# Altium schematic sheet [03] - MCU and Conn.SchDoc
size A3; DocumentNumber: 3; SheetNumber: 3; SheetTotal: 3
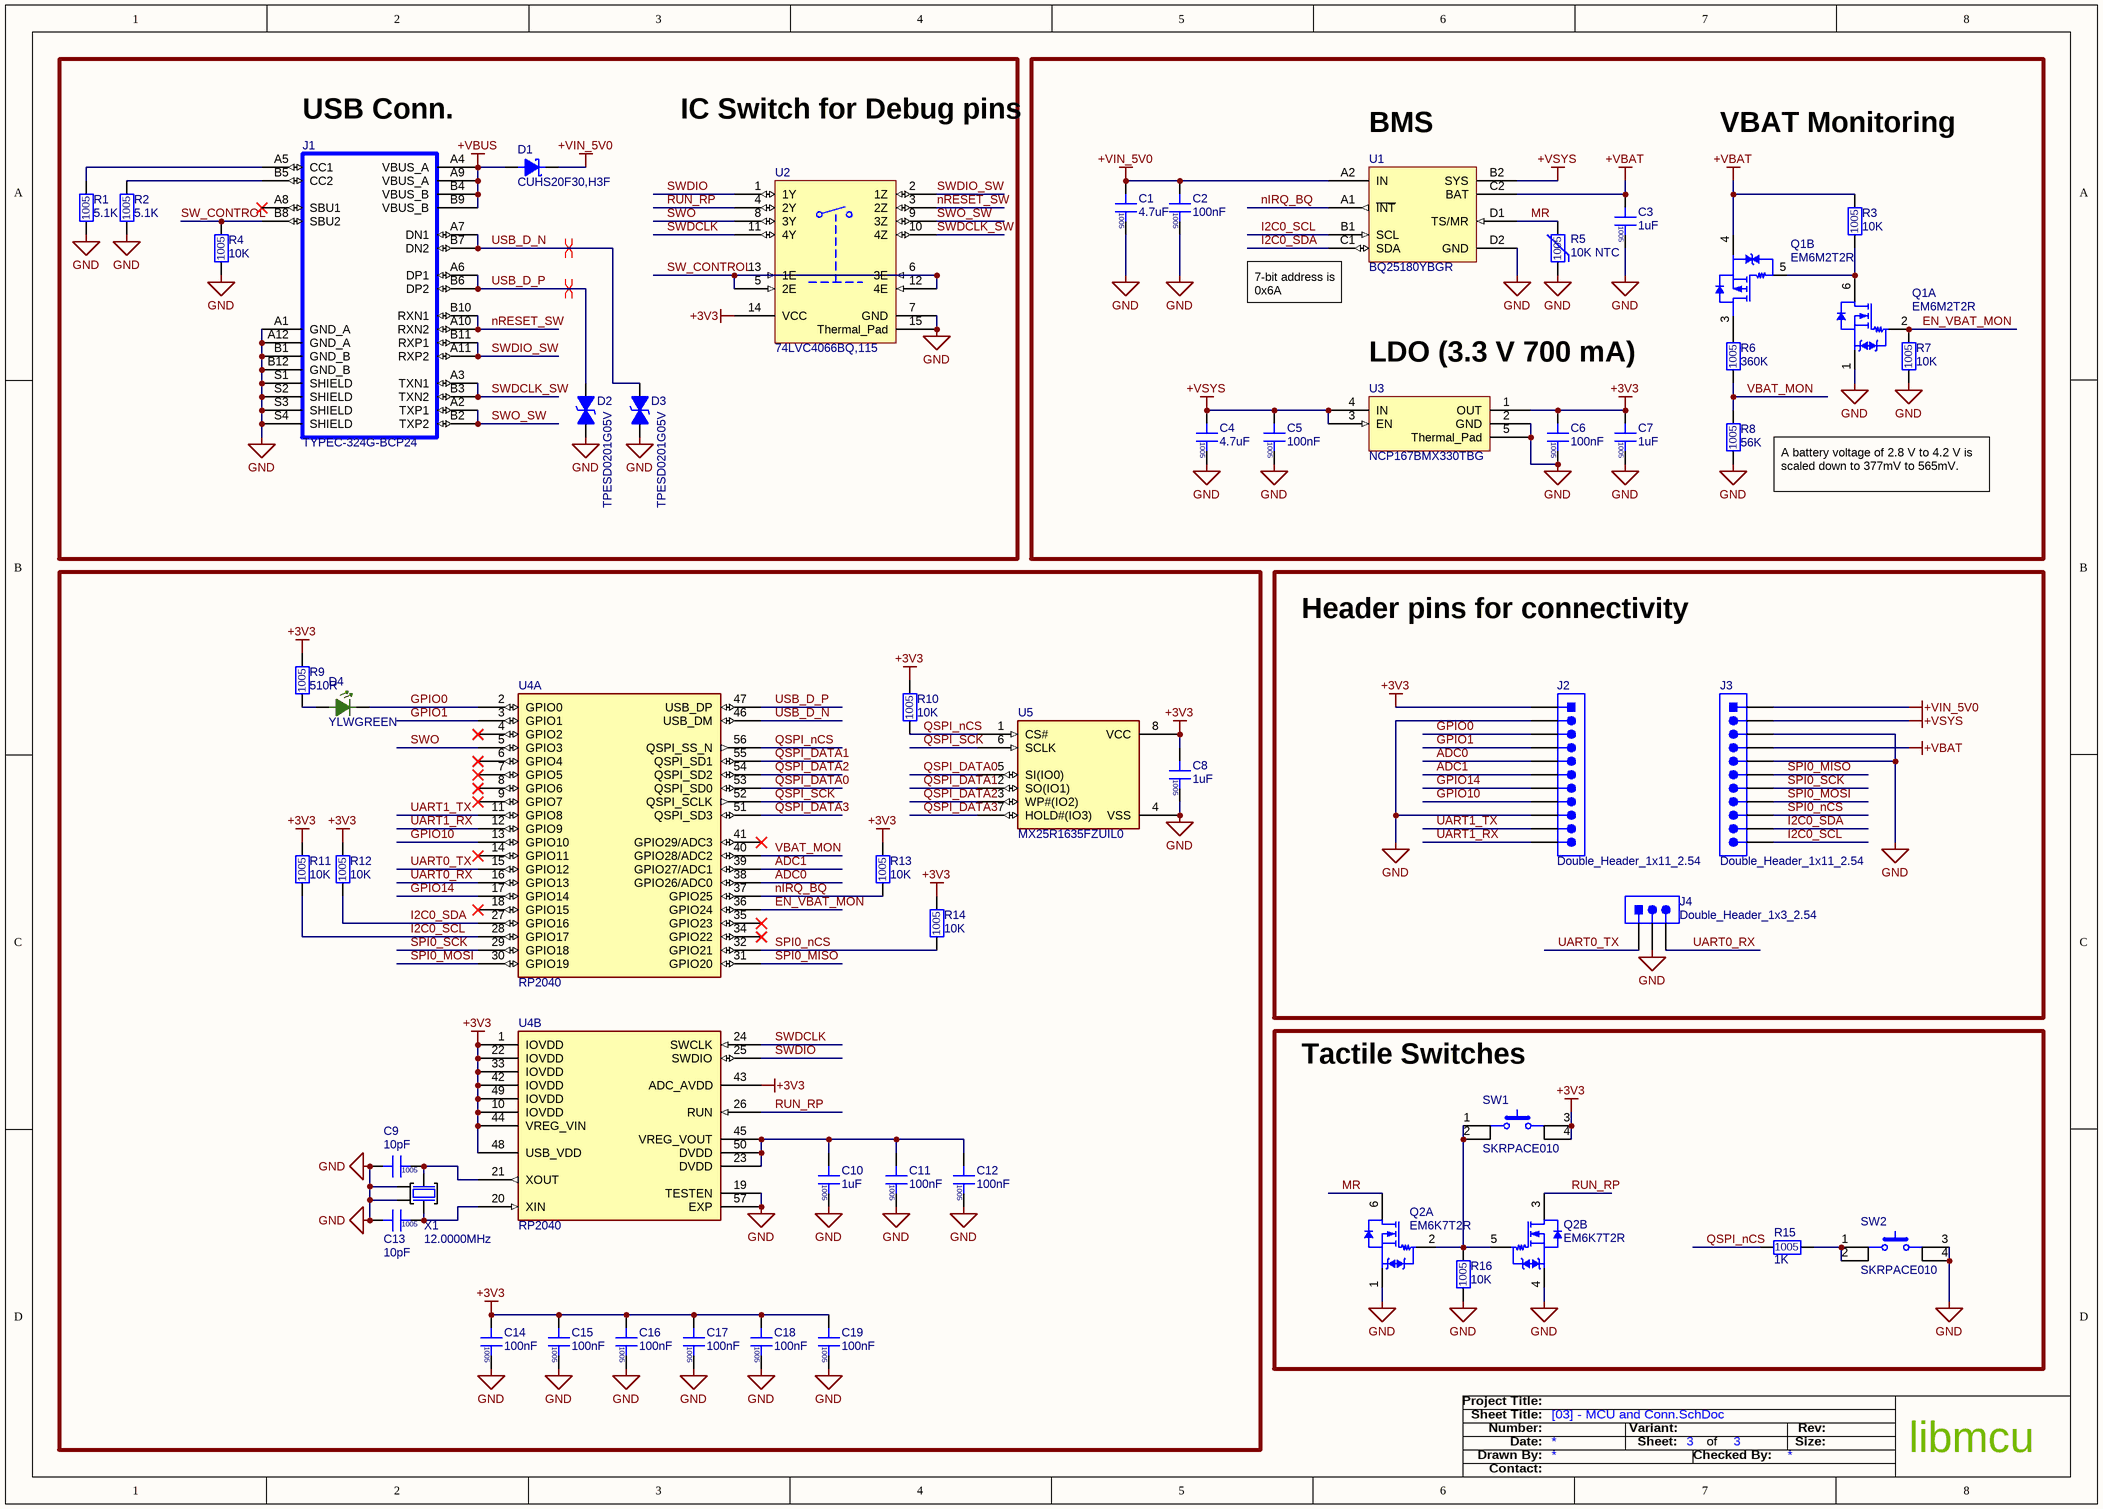
[diagram p0: [03] - MCU and Conn.SchDoc]

## Parts
C1  4.7uF  [CAPC1005X06N]
C2  100nF  [CAPC1005X06N]
C3  1uF  [CAPC1005X06N]
C4  4.7uF  [CAPC1005X06N]
C5  100nF  [CAPC1005X06N]
C6  100nF  [CAPC1005X06N]
C7  1uF  [CAPC1005X06N]
C8  1uF  [CAPC1005X06N]
C9  10pF  [CAPC1005X06N]
C10  1uF  [CAPC1005X06N]
C11  100nF  [CAPC1005X06N]
C12  100nF  [CAPC1005X06N]
C13  10pF  [CAPC1005X06N]
C14  100nF  [CAPC1005X06N]
C15  100nF  [CAPC1005X06N]
C16  100nF  [CAPC1005X06N]
C17  100nF  [CAPC1005X06N]
C18  100nF  [CAPC1005X06N]
C19  100nF  [CAPC1005X06N]
D1  CUHS20F30,H3F  [US2H-DIODE]
D2  TPESD0201G05V  [DIOC0603X03N]
D3  TPESD0201G05V  [DIOC0603X03N]
D4  YLWGREEN  [LDIOC1608X08N]
J1  TYPEC-324G-BCP24  [KUSBX-SMT3-CS-BTR_KYC]
J2  Double_Header_1x11_2.54  [1x11_DOUBLE_HEADER_2.54]  (no BOM)
J3  Double_Header_1x11_2.54  [1x11_DOUBLE_HEADER_2.54]  (no BOM)
J4  Double_Header_1x3_2.54  [1x3_DOUBLE_HEADER_2.54]  (no BOM)
Q1  EM6M2T2R  [SOTFL50P160X55-6N]  (parts A,B of 2)
Q2  EM6K7T2R  [SOTFL50P160X55-6N]  (parts A,B of 2)
R1  5.1K  [RESC1005X04N]
R2  5.1K  [RESC1005X04N]
R3  10K  [RESC1005X04N]
R4  10K  [RESC1005X04N]
R5  10K NTC  [NTC1005X05N]
R6  360K  [RESC1005X04N]
R7  10K  [RESC1005X04N]
R8  56K  [RESC1005X04N]
R9  510R  [RESC1005X04N]
R10  10K  [RESC1005X04N]
R11  10K  [RESC1005X04N]
R12  10K  [RESC1005X04N]
R13  10K  [RESC1005X04N]
R14  10K  [RESC1005X04N]
R15  1K  [RESC1005X04N]
R16  10K  [RESC1005X04N]
SW1  SKRPACE010  [PTS810]
SW2  SKRPACE010  [PTS810]
U1  BQ25180YBGR  [BGA8C40P2X4_100X155X50_YBG0008]
U2  74LVC4066BQ,115  [QFN50P250X300X100_HS-15N]
U3  NCP167BMX330TBG  [NCP167]
U4  RP2040  [QFN40P700X700X90_HS-57N_RP2040]  (parts A,B of 2)
U5  MX25R1635FZUIL0  [USON8_3X2]
X1  12.0000MHz  [XT2520]

## Blocks framed on the sheet
Header pins for connectivity: J2-J4
Tactile Switches: Q2 R15 R16 SW1 SW2

## Nets
+3V3: C6.2 C7.2 C8.2 C14.2 C15.2 C16.2 C17.2 C18.2 C19.2 J2.1 R9.1 R10.2 R11.2 R12.2 R13.2 R14.2 SW1.3 SW1.4 U2.14(VCC) U3.1(OUT) U4.1(IOVDD) U4.10(IOVDD) U4.22(IOVDD) U4.33(IOVDD) U4.42(IOVDD) U4.43(ADC_AVDD) U4.44(VREG_VIN) U4.48(USB_VDD) U4.49(IOVDD) U5.8(VCC)
+VBAT: C3.2 J3.4 Q1.4(S) R3.2 U1.C2(BAT)
+VBUS: D1.2(Anode) J1.A4(VBUS_A) J1.A9(VBUS_A) J1.B4(VBUS_B) J1.B9(VBUS_B)
+VIN_5V0: C1.2 C2.2 D1.1(Cathode) J3.1 U1.A2(IN)
+VSYS: C4.2 C5.2 J3.2 U1.B2(SYS) U3.3(EN) U3.4(IN)
GND: C1.1 C2.1 C3.1 C4.1 C5.1 C6.1 C7.1 C8.1 C9.2 C10.1 C11.1 C12.1 C13.2 C14.1 C15.1 C16.1 C17.1 C18.1 C19.1 D2.2 D3.2 J1.A1(GND_A) J1.A12(GND_A) J1.B1(GND_B) J1.B12(GND_B) J1.S1(SHIELD) J1.S2(SHIELD) J1.S3(SHIELD) J1.S4(SHIELD) J2.2 J2.9 J3.3 J3.5 J4.2 Q1.1(S) Q2.1(S) Q2.4(S) R1.1 R2.1 R4.1 R5.1 R7.1 R8.1 R16.1 SW2.3 SW2.4 U1.D2(GND) U2.7(GND) U2.15(Thermal_Pad) U3.2(GND) U3.5(Thermal_Pad) U4.19(TESTEN) U4.57(EXP) U5.4(VSS) X1.2(GND) X1.4(GND)
ADC0: J2.5 U4.38(GPIO26/ADC0)
ADC1: J2.6 U4.39(GPIO27/ADC1)
EN_VBAT_MON: Q1.2(G) R7.2 U4.36(GPIO24)
GPIO0: D4.K J2.3 U4.2(GPIO0)
GPIO1: J2.4 U4.3(GPIO1)
GPIO10: J2.8 U4.13(GPIO10)
GPIO14: J2.7 U4.17(GPIO14)
I2C0_SCL: J3.11 R11.1 U1.B1(SCL) U4.28(GPIO17)
I2C0_SDA: J3.10 R12.1 U1.C1(SDA) U4.27(GPIO16)
MR: Q2.6(D) R5.2 U1.D1(TS/MR)
nIRQ_BQ: R13.1 U1.A1(~{INT}) U4.37(GPIO25)
nRESET_SW: J1.A10(RXN2) J1.B10(RXN1) U2.3(2Z)
QSPI_DATA0: U4.53(QSPI_SD0) U5.5(SI(IO0))
QSPI_DATA1: U4.55(QSPI_SD1) U5.2(SO(IO1))
QSPI_DATA2: U4.54(QSPI_SD2) U5.3(WP#(IO2))
QSPI_DATA3: U4.51(QSPI_SD3) U5.7(HOLD#(IO3))
QSPI_nCS: R10.1 R15.1 U4.56(QSPI_SS_N) U5.1(CS#)
QSPI_SCK: U4.52(QSPI_SCLK) U5.6(SCLK)
RUN_RP: Q2.3(D) U2.4(2Y) U4.26(RUN)
SPI0_MISO: J3.6 U4.31(GPIO20)
SPI0_MOSI: J3.8 U4.30(GPIO19)
SPI0_nCS: J3.9 R14.1 U4.32(GPIO21)
SPI0_SCK: J3.7 U4.29(GPIO18)
SW_CONTROL: J1.B8(SBU2) R4.2 U2.5(2E) U2.6(3E) U2.12(4E) U2.13(1E)
SWDCLK: U2.11(4Y) U4.24(SWCLK)
SWDCLK_SW: J1.A3(TXN1) J1.B3(TXN2) U2.10(4Z)
SWDIO: U2.1(1Y) U4.25(SWDIO)
SWDIO_SW: J1.A11(RXP2) J1.B11(RXP1) U2.2(1Z)
SWO: U2.8(3Y) U4.5(GPIO3)
SWO_SW: J1.A2(TXP1) J1.B2(TXP2) U2.9(3Z)
UART0_RX: J4.3 U4.16(GPIO13)
UART0_TX: J4.1 U4.15(GPIO12)
UART1_RX: J2.11 U4.12(GPIO9)
UART1_TX: J2.10 U4.11(GPIO8)
USB_D_N: D3.1 J1.A7(DN1) J1.B7(DN2) U4.46(USB_DM)
USB_D_P: D2.1 J1.A6(DP1) J1.B6(DP2) U4.47(USB_DP)
VBAT_MON: R6.1 R8.2 U4.40(GPIO28/ADC2)
NetC9_1: C9.1 U4.21(XOUT) X1.1(IN)
NetC10_2: C10.2 C11.2 C12.2 U4.23(DVDD) U4.45(VREG_VOUT) U4.50(DVDD)
NetC13_1: C13.1 U4.20(XIN) X1.3(OUT)
NetD4_A: D4.A R9.2
NetJ1_A5: J1.A5(CC1) R1.2
NetJ1_B5: J1.B5(CC2) R2.2
NetQ1_3: Q1.3(D) R6.2
NetQ1_5: Q1.5(G) Q1.6(D) R3.1
NetQ2_2: Q2.2(G) Q2.5(G) R16.2 SW1.1 SW1.2
NetR15_2: R15.2 SW2.1 SW2.2

Not connected (* = marked no-connect by the designer): J1 A8(SBU1)*; U4 4(GPIO2)* 6(GPIO4)* 7(GPIO5)* 8(GPIO6)* 9(GPIO7)* 14(GPIO11)* 18(GPIO15)* 34(GPIO22)* 35(GPIO23)* 41(GPIO29/ADC3)*

## Layout directives
differential pair; differential pair class DIFF90: USB_D_N, USB_D_P

## Notes on the sheet
- (near J1) USB Conn.
- IC Switch for Debug pins
- (near U1) BMS
- VBAT Monitoring
- (near U1) 7-bit address is 0x6A
- LDO (3.3 V 700 mA)
- (near R8) A battery voltage of 2.8 V to 4.2 V is scaled down to 377mV to 565mV.
- Project Title:
- Number:
- Date:
- Sheet Title:
- Drawn By:
- Sheet:
- Variant:
- of
- Checked By:
- Rev:
- Size:
- libmcu
- Contact:

## Library data of the parts
C1 C4 = CL05A475MP5NRNC: CAP CER 4.7UF 10V X5R 0402; Manufacturer: Samsung; Tolerance: 20%; Supplier 1: Digi-Key; Supplier Part Number 1: 1276-1482-1-ND; Manufacturer Part Number: CL05A475MP5NRNC; RoHS: Yes; Category: Ceramic Capacitors; Stock 1: 6997940; Pricing 1: 1=0.10000, 10=0.06800, 50=0.03680, 100=0.03010, 500=0.02150, 1000=0.01689, 2500=0.01535, 5000=0.01412 (USD); Mount: Surface Mount; Case/Package: 0402; Case Code (Metric): 1005; Case Code (Imperial): 0402; Min Operating Temperature: -55°C; Max Operating Temperature: 85°C; Package Quantity: 10000; Packaging: Tape and Reel; Capacitance: 4.7uF; Voltage Rating: 10V; Dielectric: X5R; Series: CL; Length: 0.039inch; Width: 0.02inch; Thickness: 0.022inch; Lead Free: Lead Free; RoHS Compliant: Yes; ComponentLink1URL: https://datasheet.ciiva.com/25786/cl05a475mp5nrnc-25786963.pdf?src-supplier=Digi-Key; ComponentLink1Description: https://datasheet.ciiva.com/25786/cl05a475mp5nrnc-25786963.pdf?src-supplier=Digi-Key; ComponentLink2URL: https://datasheet.ciiva.com/16437/cl05b104kq5nnnc-16437353.pdf?src-supplier=Future+Electronics; ComponentLink2Description: https://datasheet.ciiva.com/16437/cl05b104kq5nnnc-16437353.pdf?src-supplier=Future+Electronics
C2 C5 C6 C11 C12 C14-C19 = CL05B104KO5NNNC: CAP CER 0.1UF 16V X7R 0402; Manufacturer: Samsung; Material: Ceramic; Tolerance: 10%; Supplier 1: Digi-Key; Supplier Part Number 1: 1276-1001-1-ND; Manufacturer Part Number: CL05B104KO5NNNC; RoHS: Yes; Category: Ceramic Capacitors; Stock 1: 21029609; Pricing 1: 1=0.10000, 10=0.02600, 50=0.01400, 100=0.01150, 500=0.00820, 1000=0.00644, 2500=0.00586, 5000=0.00539 (USD); Mount: Surface Mount; Case/Package: 0402; Case Code (Metric): 1005; Case Code (Imperial): 0402; Contact Plating: Tin; Min Operating Temperature: -55°C; Max Operating Temperature: 125°C; Capacitance: 100nF; Dielectric: X7R; Package Quantity: 1; Packaging: Tape and Reel; Voltage Rating: 16V; Voltage: 16V; Voltage Rating (DC): 16V; Length: 1mm; Width: 0.02inch; Height: 0.5mm; Thickness: 0.022inch; Depth: 0.5mm; Radiation Hardening: No; Lead Free: Lead Free; ComponentLink1URL: https://datasheet.ciiva.com/26920/getdatasheetpartid-359683-26920169.pdf?src-supplier=Verical; ComponentLink1Description: https://datasheet.ciiva.com/26920/getdatasheetpartid-359683-26920169.pdf?src-supplier=Verical; ComponentLink2URL: https://datasheet.ciiva.com/29198/458718-da-01-en-vs-kondensator-0402-29198423.pdf?src-supplier=Conrad; ComponentLink2Description: https://datasheet.ciiva.com/29198/458718-da-01-en-vs-kondensator-0402-29198423.pdf?src-supplier=Conrad; ComponentLink3URL: https://datasheet.ciiva.com/16208/cl05b104kq5nnnc-16208343.pdf?src-supplier=Future+Electronics; ComponentLink3Description: https://datasheet.ciiva.com/16208/cl05b104kq5nnnc-16208343.pdf?src-supplier=Future+Electronics; ComponentLink4URL: https://datasheet.ciiva.com/26309/mlcc-catalogdownload2013-eng-26309003.pdf?src-supplier=Distrelec; ComponentLink4Description: https://datasheet.ciiva.com/26309/mlcc-catalogdownload2013-eng-26309003.pdf?src-supplier=Distrelec
C3 C7 C8 C10 = CL05A105KO5NNNC: CAP CER 1UF 16V X5R 0402; Manufacturer: Samsung; Tolerance: 10%; Supplier 1: Digi-Key; Supplier Part Number 1: 1276-1067-1-ND; Manufacturer Part Number: CL05A105KO5NNNC; RoHS: Yes; Category: Ceramic Capacitors; Stock 1: 2455652; Pricing 1: 1=0.10000, 10=0.04400, 50=0.02400, 100=0.01960, 500=0.01402, 1000=0.01101, 2500=0.01001, 5000=0.00921 (USD); Mount: Surface Mount; Case/Package: 0402; Contact Plating: Tin; Case Code (Imperial): 0402; Case Code (Metric): 1005; Min Operating Temperature: -55°C; Max Operating Temperature: 85°C; Capacitance: 1uF; Dielectric: X5R; Packaging: Tape and Reel; Package Quantity: 1; Voltage Rating: 16V; Voltage: 16V; Length: 1mm; Width: 0.02inch; Height: 0.5mm; Thickness: 0.022inch; Depth: 0.5mm; Radiation Hardening: No; ComponentLink1URL: https://datasheet.ciiva.com/16207/cl05a105ko5nnnc-16207571.pdf?src-supplier=Future+Electronics; ComponentLink1Description: https://datasheet.ciiva.com/16207/cl05a105ko5nnnc-16207571.pdf?src-supplier=Future+Electronics; ComponentLink2URL: https://datasheet.ciiva.com/15195/getdatasheetpartid-355272-15195629.pdf?src-supplier=Verical; ComponentLink2Description: https://datasheet.ciiva.com/15195/getdatasheetpartid-355272-15195629.pdf?src-supplier=Verical
C9 C13 = CL05C100DB5NNNC: CAP CER 10PF 50V C0G/NP0 0402; Manufacturer 1: Samsung; Dielectric: C0G; Category 1: Capacitors; Category 2: Ceramic Capacitors; Supplier 1: Digi-Key; Manufacturer Part Number 1: CL05C100DB5NNNC; Stock 1: 197409; Pricing 1: 1=0.10000, 10=0.03800, 100=0.01680, 500=0.01198, 1000=0.00941, 2500=0.00855, 5000=0.00787 (USD); RoHS: Yes; Mount: Surface Mount; Case/Package: 0402; Case Code (Imperial): 0402; Case Code (Metric): 1005; Min Operating Temperature: -55°C; Max Operating Temperature: 125°C; Packaging: Tape and Reel; Package Quantity: 1; Voltage Rating: 50V; Voltage Rating (DC): 50V; Capacitance: 10pF; Length: 1mm; Height: 0.5mm; Width: 0.02inch; Thickness: 0.022inch; Depth: 0.5mm; Radiation Hardening: No; Lead Free: Lead Free; ComponentLink1URL: https://datasheet.ciiva.com/25805/cl05c100db5nnnc-25805476.pdf?src-supplier=Digi-Key; ComponentLink1Description: https://datasheet.ciiva.com/25805/cl05c100db5nnnc-25805476.pdf?src-supplier=Digi-Key; ComponentLink2URL: https://datasheet.ciiva.com/16427/cl05c100db5nnnc-16427321.pdf?src-supplier=Future+Electronics; ComponentLink2Description: https://datasheet.ciiva.com/16427/cl05c100db5nnnc-16427321.pdf?src-supplier=Future+Electronics; Supplier Part Number 1: 1276-1625-1-ND; Manufacturer: Samsung; Manufacturer Part Number: CL05C100DB5NNNC
D1 = CUHS20F30,H3F: DIODE SCHOTTKY 30V 2A US2H; Manufacturer: Toshiba; Supplier 1: Digi-Key; Supplier Part Number 1: CUHS20F30H3FCT-ND; Manufacturer Part Number: CUHS20F30,H3F; RoHS: No; Stock 1: 70970; Pricing 1: 1=0.37000, 10=0.30200, 100=0.20540, 500=0.15408, 1000=0.11556 (USD)
D2 D3 = TPESD0201G05V: TVS DIODE 5.5VWM 40VC 0201; Manufacturer: TECH PUBLIC; Number of Bidirectional Channels: 1; Reverse Standoff Voltage: 5.5V; Clamping Voltage: 40V; Power Line Protection: No; Peak Pulse Current: 3A; Manufacturer Part Number: TPESD0201G05V; RoHS: Yes; Category: Diodes; Mount: Surface Mount; Case/Package: SMD/SMT; Min Operating Temperature: -55°C; Max Operating Temperature: 125°C; Packaging: Tape and Reel; Resistor Type: Zener; Lead Free: Lead Free; Halogen Free: Halogen Free; RoHS Compliant: Yes; ComponentLink1Description: https://datasheet.lcsc.com/lcsc/2005211235_TECH-PUBLIC-TPESD0201G15V_C558460.pdf; ComponentLink1URL: https://datasheet.lcsc.com/lcsc/2005211235_TECH-PUBLIC-TPESD0201G15V_C558460.pdf
D4 = 19-217/G7C-AN1P2/3T: LED YLW/GREEN DIFFUSED 1608 SMD; Manufacturer: Everlight; Color: Green,Yellow; Forward Voltage: 2V; Lens Style: Clear,Diffused,Colorless,Rectangular; Viewing Angle: 120°; Number of LEDs: 1; Supplier 1: Win Source Electronics; Supplier Part Number 1: 5203-19-217/G7C-AN1P2/3T; Manufacturer Part Number: 19-217/G7C-AN1P2/3T; RoHS: Yes; Category: LEDs; Stock 1: 152500; Pricing 1: 2635=0.01900, 6250=0.01600, 10000=0.01500, 13335=0.01500, 17860=0.01400, 23080=0.01300 (USD); Mounting Technology: Surface Mount; Pins: 2; Lead Free: Lead Free; RoHS Compliant: Yes; ComponentLink1URL: https://datasheet.ciiva.com/48679/19-217-g7c-an1p2-3t-48679179.pdf?src-supplier=Avnet; ComponentLink1Description: https://datasheet.ciiva.com/48679/19-217-g7c-an1p2-3t-48679179.pdf?src-supplier=Avnet
J1 = TYPEC-324G-BCP24: CONN RCPT USB TYPE C, SMT PINS, TH SHIELD; Manufacturer: XUNPU; Manufacturer Part Number: TYPEC-324G-BCP24; Category: USB Connectors; ComponentLink1Description: https://www.lcsc.com/product-detail/USB-Connectors_XUNPU-TYPEC-324G-BCP24_C920230.html; ComponentLink1URL: https://www.lcsc.com/product-detail/USB-Connectors_XUNPU-TYPEC-324G-BCP24_C920230.html
Q1 = EM6M2T2R: MOSFET N/P-CH 20V 0.2A EMT6; Manufacturer: Rohm; Continuous Drain Current (ID): 200mA; Rds On Max: 1R; Input Capacitance: 25pF; Max Power Dissipation: 150mW; FET Type: N and P-Channel; Supplier 1: Digi-Key; Supplier Part Number 1: EM6M2T2RCT-ND; Manufacturer Part Number: EM6M2T2R; RoHS: Yes; Category: MOSFETs; Stock 1: 90900; Pricing 1: 1=0.58000, 10=0.49600, 100=0.37030, 500=0.29096, 1000=0.22482, 2000=0.20499 (USD); Mounting Technology: Surface Mount; Case/Package: SOT-23-5; Pins: 6; Min Operating Temperature: -55°C; Max Operating Temperature: 150°C; Packaging: Tape and Reel; Package Quantity: 1; Drain to Source Voltage (Vdss): 20V; Drain to Source Resistance: 1R; Drain-source On Resistance-Max: 1R; Radiation Hardening: No; Lead Free: Lead Free; RoHS Compliant: Yes; ComponentLink1URL: https://datasheet.ciiva.com/6387/em6m2-6387413.pdf?src-supplier=Digi-Key; ComponentLink1Description: https://datasheet.ciiva.com/6387/em6m2-6387413.pdf?src-supplier=Digi-Key; ComponentLink2URL: https://datasheet.ciiva.com/6387/em6m2-6387415.pdf?src-supplier=Digi-Key; ComponentLink2Description: https://datasheet.ciiva.com/6387/em6m2-6387415.pdf?src-supplier=Digi-Key; ComponentLink3URL: https://datasheet.ciiva.com/6387/em6m2-6387417.pdf?src-supplier=Digi-Key; ComponentLink3Description: https://datasheet.ciiva.com/6387/em6m2-6387417.pdf?src-supplier=Digi-Key
Q2 = EM6K7T2R: MOSFET 2N-CH 20V 0.2A EMT6; Manufacturer: Rohm; Rise Time: 10ns; Rds On Max: 1.2R; Input Capacitance: 25pF; Continuous Drain Current (ID): 200mA; Max Power Dissipation: 150mW; Turn-On Delay Time: 5ns; Turn-Off Delay Time: 15ns; Gate to Source Voltage (Vgs): 8V; FET Type: 2 N-Channel; Supplier 1: Digi-Key; Supplier Part Number 1: EM6K7T2RCT-ND; Manufacturer Part Number: EM6K7T2R; RoHS: Yes; Category: MOSFETs; Stock 1: 15154; Pricing 1: 1=0.54000, 10=0.43900, 100=0.29900, 500=0.22428, 1000=0.16821, 2000=0.15419 (USD); Mounting Technology: Surface Mount; Pins: 6; Min Operating Temperature: -55°C; Max Operating Temperature: 150°C; Package Quantity: 8000; Packaging: Tape and Reel; Drain to Source Voltage (Vdss): 20V; Fall Time: 10ns; Drain to Source Resistance: 1.2R; Drain-source On Resistance-Max: 1.2R; Radiation Hardening: No; Lead Free: Lead Free; RoHS Compliant: Yes; ComponentLink1URL: https://datasheet.ciiva.com/6387/em6k7-6387446.pdf?src-supplier=Digi-Key; ComponentLink1Description: https://datasheet.ciiva.com/6387/em6k7-6387446.pdf?src-supplier=Digi-Key; ComponentLink2URL: https://datasheet.ciiva.com/13051/em6k7-209726-13051863.pdf?src-supplier=Mouser; ComponentLink2Description: https://datasheet.ciiva.com/13051/em6k7-209726-13051863.pdf?src-supplier=Mouser; ComponentLink3URL: https://datasheet.ciiva.com/11162/em6k7-11162107.pdf?src-supplier=Avnet; ComponentLink3Description: https://datasheet.ciiva.com/11162/em6k7-11162107.pdf?src-supplier=Avnet; ComponentLink4URL: https://datasheet.ciiva.com/6387/em6k7-6387451.pdf?src-supplier=Digi-Key; ComponentLink4Description: https://datasheet.ciiva.com/6387/em6k7-6387451.pdf?src-supplier=Digi-Key; ComponentLink5URL: https://datasheet.ciiva.com/16437/em6k7-16437677.pdf?src-supplier=Future+Electronics; ComponentLink5Description: https://datasheet.ciiva.com/16437/em6k7-16437677.pdf?src-supplier=Future+Electronics
R1 R2 = RC0402FR-075K1L: RES SMD 5.1K OHM 1% 1/16W 0402; Manufacturer: Yageo; Power Rating: 63mW; Resistance: 5.1kR; Temperature Coefficient: 100ppm/°C; Voltage Rating: 50V; Supplier 1: Digi-Key; Supplier Part Number 1: 311-5.10KLRCT-ND; Manufacturer Part Number: RC0402FR-075K1L; RoHS: Yes; Category: Chip SMD Resistors; Stock 1: 1329359; Pricing 1: 1=0.10000, 10=0.01600, 100=0.00660, 1000=0.00299, 2500=0.00259, 5000=0.00214 (USD); Case/Package: 0402; Case Code (Metric): 1005; Case Code (Imperial): 0402; Min Operating Temperature: -55°C; Max Operating Temperature: 155°C; Tolerance: 1%; Technology: THICK FILM; Packaging: Tape and Reel; Package Quantity: 1; Resistor Type: Thick Film; Number of Terminations: 2; Termination: SMD/SMT; Max Power Dissipation: 63mW; Voltage Rating (DC): 50V; Working Voltage: 50V; Features: Moisture Resistant; Series: RC; Resistance Tolerance: 1%; Construction: Rectangular; Length: 1mm; Width: 0.02inch; Height: 0.016inch; Depth: 0.5mm; RoHS Compliant: Yes; REACH SVHC: Unknown; Military Standard: Not; Lead Free: Lead Free; ComponentLink1URL: https://datasheet.ciiva.com/2453/pyu-r-int-thick-7-2453400.pdf?src-supplier=Digi-Key; ComponentLink1Description: https://datasheet.ciiva.com/2453/pyu-r-int-thick-7-2453400.pdf?src-supplier=Digi-Key; ComponentLink2URL: https://datasheet.ciiva.com/2453/pyu-r-int-thick-7-2453401.pdf?src-supplier=Digi-Key; ComponentLink2Description: https://datasheet.ciiva.com/2453/pyu-r-int-thick-7-2453401.pdf?src-supplier=Digi-Key; ComponentLink3URL: https://datasheet.ciiva.com/2453/pyu-r-int-thick-7-2453402.pdf?src-supplier=Digi-Key; ComponentLink3Description: https://datasheet.ciiva.com/2453/pyu-r-int-thick-7-2453402.pdf?src-supplier=Digi-Key; ComponentLink4URL: https://datasheet.ciiva.com/12558/pyu-rc0402-51-rohs-l-6-r-8721-12558460.pdf?src-supplier=Mouser; ComponentLink4Description: https://datasheet.ciiva.com/12558/pyu-rc0402-51-rohs-l-6-r-8721-12558460.pdf?src-supplier=Mouser; ComponentLink5URL: https://datasheet.ciiva.com/16744/pyu-rc0402-51-rohs-l-6-r-16744283.pdf?src-supplier=Future+Electronics; ComponentLink5Description: https://datasheet.ciiva.com/16744/pyu-rc0402-51-rohs-l-6-r-16744283.pdf?src-supplier=Future+Electronics; ComponentLink6URL: https://datasheet.ciiva.com/15189/getdatasheetpartid-323636-15189493.pdf?src-supplier=Verical; ComponentLink6Description: https://datasheet.ciiva.com/15189/getdatasheetpartid-323636-15189493.pdf?src-supplier=Verical; ComponentLink7URL: https://datasheet.ciiva.com/7983/1018594-7983519.pdf?src-supplier=Element14; ComponentLink7Description: https://datasheet.ciiva.com/7983/1018594-7983519.pdf?src-supplier=Element14; ComponentLink8URL: https://datasheet.ciiva.com/46394/1018594-46394936.pdf?src-supplier=Element14; ComponentLink8Description: https://datasheet.ciiva.com/46394/1018594-46394936.pdf?src-supplier=Element14
R3 R4 R7 R10-R14 R16 = RC0402FR-0710KL: RES SMD 10K OHM 1% 1/16W 0402; Manufacturer: Yageo; Resistance: 10kR; Temperature Coefficient: 100ppm/°C; Voltage Rating (DC): 50V; Power Rating: 62.5mW; Max Power Dissipation: 63mW; Supplier 1: Digi-Key; Supplier Part Number 1: 311-10.0KLRCT-ND; Manufacturer Part Number: RC0402FR-0710KL; RoHS: Yes; Category: Chip SMD Resistors; Stock 1: 39209283; Pricing 1: 1=0.10000, 10=0.01400, 100=0.00580, 1000=0.00260, 2500=0.00226, 5000=0.00186 (USD); Case/Package: 0402; Number of Pins: 2; Case Code (Imperial): 0402; Case Code (Metric): 1005; Min Operating Temperature: -55°C; Max Operating Temperature: 155°C; Resistor Type: Thick Film; Tolerance: 1%; Packaging: Tape and Reel; Voltage Rating: 50V; Termination: SMD/SMT; Working Voltage: 50V; Number of Terminations: 2; Features: Moisture Resistant; Series: RC; Resistance Tolerance: 1%; Construction: Rectangular; Length: 1mm; Width: 0.5mm; Height: 0.32mm; Depth: 0.5mm; Lead Pitch: 0.2mm; REACH SVHC: No SVHC; Lead Free: Lead Free; RoHS Compliant: Yes; Military Standard: Not; ComponentLink1URL: https://datasheet.ciiva.com/7660/38568-7660787.pdf?src-supplier=Element14; ComponentLink1Description: https://datasheet.ciiva.com/7660/38568-7660787.pdf?src-supplier=Element14; ComponentLink2URL: https://datasheet.ciiva.com/7983/1018594-7983486.pdf?src-supplier=Element14; ComponentLink2Description: https://datasheet.ciiva.com/7983/1018594-7983486.pdf?src-supplier=Element14; ComponentLink3URL: https://datasheet.ciiva.com/7849/1784430-7849813.pdf?src-supplier=Element14; ComponentLink3Description: https://datasheet.ciiva.com/7849/1784430-7849813.pdf?src-supplier=Element14; ComponentLink4URL: https://datasheet.ciiva.com/7849/1686128-7849814.pdf?src-supplier=Element14; ComponentLink4Description: https://datasheet.ciiva.com/7849/1686128-7849814.pdf?src-supplier=Element14; ComponentLink5URL: https://datasheet.ciiva.com/7849/1784430-7849815.pdf?src-supplier=Element14; ComponentLink5Description: https://datasheet.ciiva.com/7849/1784430-7849815.pdf?src-supplier=Element14; ComponentLink6URL: https://datasheet.ciiva.com/22747/1018594-22747512.pdf?src-supplier=Element14; ComponentLink6Description: https://datasheet.ciiva.com/22747/1018594-22747512.pdf?src-supplier=Element14; ComponentLink7URL: https://datasheet.ciiva.com/12667/pyu-rc0402-51-rohs-l-6-r-12667067.pdf?src-supplier=Mouser; ComponentLink7Description: https://datasheet.ciiva.com/12667/pyu-rc0402-51-rohs-l-6-r-12667067.pdf?src-supplier=Mouser
R5 = NCP15XH103F03RC: THERMISTOR NTC 10KOHM 3380K 0402; Manufacturer: Murata; Tolerance: 1%; Value: 10kR; Power Rating: 100mW; Current Rating: 310uA; Supplier 1: Digi-Key; Supplier Part Number 1: 490-4801-1-ND; Manufacturer Part Number: NCP15XH103F03RC; RoHS: Yes; Category: Thermistors; Stock 1: 408773; Pricing 1: 1=0.14000, 5=0.13000, 10=0.11600, 25=0.10360, 50=0.09120, 100=0.07770, 500=0.06428, 1000=0.05381, 5000=0.04783 (USD); Mounting Technology: Surface Mount; Case/Package: 0402; Pins: 2; Case Code (Metric): 1005; Case Code (Imperial): 0402; Min Operating Temperature: -40°C; Max Operating Temperature: 125°C; Packaging: Tape and Reel; Package Quantity: 1; Max Power Dissipation: 100mW; Termination: SMD/SMT; Series: NCP; Resistance Tolerance: 1%; Length: 1mm; Height: 0.5mm; Depth: 0.5mm; Radiation Hardening: No; Reach SVHC Compliant: Yes; Lead Free: Lead Free; RoHS Compliant: Yes; ComponentLink1URL: https://datasheet.ciiva.com/2848/r44e-2848224.pdf?src-supplier=Digi-Key; ComponentLink1Description: https://datasheet.ciiva.com/2848/r44e-2848224.pdf?src-supplier=Digi-Key; ComponentLink2URL: https://datasheet.ciiva.com/2848/r44e-2848223.pdf?src-supplier=Digi-Key; ComponentLink2Description: https://datasheet.ciiva.com/2848/r44e-2848223.pdf?src-supplier=Digi-Key; ComponentLink3URL: https://datasheet.ciiva.com/2848/r44e-2848225.pdf?src-supplier=Digi-Key; ComponentLink3Description: https://datasheet.ciiva.com/2848/r44e-2848225.pdf?src-supplier=Digi-Key; ComponentLink4URL: https://datasheet.ciiva.com/3280/l0770e-3280495.pdf?src-supplier=Avnet; ComponentLink4Description: https://datasheet.ciiva.com/3280/l0770e-3280495.pdf?src-supplier=Avnet; ComponentLink5URL: https://datasheet.ciiva.com/16208/ncp15wb473j03rc-16208150.pdf?src-supplier=Future+Electronics; ComponentLink5Description: https://datasheet.ciiva.com/16208/ncp15wb473j03rc-16208150.pdf?src-supplier=Future+Electronics
R6 = RC0402FR-07360KL: RES SMD 360K OHM 1% 1/16W 0402; Manufacturer: Yageo; Value: 360kR; Temperature Coefficient: 100ppm/°C; Power Rating: 62.5mW; Voltage Rating: 50V; Max Power Dissipation: 63mW; Supplier 1: Digi-Key; Supplier Part Number 1: 311-360KLRCT-ND; Manufacturer Part Number: RC0402FR-07360KL; RoHS: Yes; Category: Chip SMD Resistors; Stock 1: 662020; Pricing 1: 1=0.10000, 10=0.01400, 100=0.00580, 1000=0.00262, 2500=0.00228, 5000=0.00188 (USD); Case/Package: 0402; Contact Plating: Tin,Matte; Case Code (Metric): 1005; Case Code (Imperial): 0402; Min Operating Temperature: -55°C; Max Operating Temperature: 155°C; Tolerance: 1%; Resistor Type: Thick Film; Packaging: Tape and Reel; Package Quantity: 1; Number of Terminations: 2; Termination: SMD/SMT; Voltage Rating (DC): 50V; Features: Moisture Resistant; Series: RC; Construction: Rectangular; Resistance Tolerance: 1%; Length: 1mm; Width: 0.02inch; Height: 0.016inch; Depth: 0.5mm; Military Standard: Not; Lead Free: Lead Free; RoHS Compliant: Yes; ComponentLink1URL: https://datasheet.ciiva.com/2453/pyu-r-int-thick-7-2453620.pdf?src-supplier=Digi-Key; ComponentLink1Description: https://datasheet.ciiva.com/2453/pyu-r-int-thick-7-2453620.pdf?src-supplier=Digi-Key; ComponentLink2URL: https://datasheet.ciiva.com/2453/pyu-r-int-thick-7-2453621.pdf?src-supplier=Digi-Key; ComponentLink2Description: https://datasheet.ciiva.com/2453/pyu-r-int-thick-7-2453621.pdf?src-supplier=Digi-Key; ComponentLink3URL: https://datasheet.ciiva.com/2453/pyu-r-int-thick-7-2453619.pdf?src-supplier=Digi-Key; ComponentLink3Description: https://datasheet.ciiva.com/2453/pyu-r-int-thick-7-2453619.pdf?src-supplier=Digi-Key; ComponentLink4URL: https://datasheet.ciiva.com/12561/pyu-rc0402-51-rohs-l-6-r-8721-12561150.pdf?src-supplier=Mouser; ComponentLink4Description: https://datasheet.ciiva.com/12561/pyu-rc0402-51-rohs-l-6-r-8721-12561150.pdf?src-supplier=Mouser; ComponentLink5URL: https://datasheet.ciiva.com/8886/pyu-rc0402-51-rohs-l-6-8886029.pdf?src-supplier=Avnet; ComponentLink5Description: https://datasheet.ciiva.com/8886/pyu-rc0402-51-rohs-l-6-8886029.pdf?src-supplier=Avnet; ComponentLink6URL: https://datasheet.ciiva.com/16742/pyu-rc0402-51-rohs-l-6-r-16742217.pdf?src-supplier=Future+Electronics; ComponentLink6Description: https://datasheet.ciiva.com/16742/pyu-rc0402-51-rohs-l-6-r-16742217.pdf?src-supplier=Future+Electronics
R8 = RC0402FR-0756KL: RES SMD 56K OHM 1% 1/16W 0402; Manufacturer: Yageo; Power Rating: 62.5mW; Temperature Coefficient: 100ppm/°C; Resistance: 56kR; Voltage Rating: 50V; Max Power Dissipation: 63mW; Supplier 1: Digi-Key; Supplier Part Number 1: 311-56.0KLRCT-ND; Manufacturer Part Number: RC0402FR-0756KL; RoHS: Yes; Category: Chip SMD Resistors; Stock 1: 724545; Pricing 1: 1=0.10000, 10=0.01600, 100=0.00660, 1000=0.00299, 2500=0.00259, 5000=0.00214 (USD); Case/Package: 0402; Case Code (Metric): 1005; Case Code (Imperial): 0402; Min Operating Temperature: -55°C; Max Operating Temperature: 155°C; Tolerance: 1%; Series: RC; Technology: THICK FILM; Package Quantity: 1; Packaging: Tape and Reel; Resistor Type: Thick Film; Number of Terminations: 2; Termination: SMD/SMT; Working Voltage: 50V; Features: Moisture Resistant; Construction: Rectangular; Resistance Tolerance: 1%; Length: 1mm; Width: 0.02inch; Height: 0.016inch; Depth: 0.5mm; RoHS Compliant: Yes; REACH SVHC: No SVHC; Military Standard: Not; Lead Free: Lead Free; ComponentLink1URL: https://datasheet.ciiva.com/46412/1018594-46412840.pdf?src-supplier=Element14; ComponentLink1Description: https://datasheet.ciiva.com/46412/1018594-46412840.pdf?src-supplier=Element14; ComponentLink2URL: https://datasheet.ciiva.com/2453/pyu-r-int-thick-7-2453479.pdf?src-supplier=Digi-Key; ComponentLink2Description: https://datasheet.ciiva.com/2453/pyu-r-int-thick-7-2453479.pdf?src-supplier=Digi-Key; ComponentLink3URL: https://datasheet.ciiva.com/2453/pyu-r-int-thick-7-2453480.pdf?src-supplier=Digi-Key; ComponentLink3Description: https://datasheet.ciiva.com/2453/pyu-r-int-thick-7-2453480.pdf?src-supplier=Digi-Key; ComponentLink4URL: https://datasheet.ciiva.com/2453/pyu-r-int-thick-7-2453478.pdf?src-supplier=Digi-Key; ComponentLink4Description: https://datasheet.ciiva.com/2453/pyu-r-int-thick-7-2453478.pdf?src-supplier=Digi-Key; ComponentLink5URL: https://datasheet.ciiva.com/5558/pyu-rc0402-51-rohs-l-6-r-5558279.pdf?src-supplier=Mouser; ComponentLink5Description: https://datasheet.ciiva.com/5558/pyu-rc0402-51-rohs-l-6-r-5558279.pdf?src-supplier=Mouser; ComponentLink6URL: https://datasheet.ciiva.com/7850/1018594-7850045.pdf?src-supplier=Element14; ComponentLink6Description: https://datasheet.ciiva.com/7850/1018594-7850045.pdf?src-supplier=Element14; ComponentLink7URL: https://datasheet.ciiva.com/7850/1018594-7850044.pdf?src-supplier=Element14; ComponentLink7Description: https://datasheet.ciiva.com/7850/1018594-7850044.pdf?src-supplier=Element14
R9 = RC0402FR-07510RL: RES SMD 510 OHM 1% 1/16W 0402; Manufacturer 1: Yageo; Voltage Rating (DC): 50V; Power Rating: 63mW; Temperature Coefficient: 100ppm/°C; Category 1: Resistors; Category 2: Chip Resistor - Surface Mount; Supplier 1: Digi-Key; Manufacturer Part Number 1: RC0402FR-07510RL; Stock 1: 458379; Pricing 1: 1=0.10000, 10=0.01600, 100=0.00640, 1000=0.00289, 2500=0.00251, 5000=0.00207 (USD); RoHS: Yes; Case/Package: 0402; Weight: 2.3E-05oz; Case Code (Imperial): 0402; Case Code (Metric): 1005; Min Operating Temperature: -55°C; Max Operating Temperature: 155°C; Features: Moisture Resistant; Tolerance: 1%; Packaging: Tape and Reel; Package Quantity: 1; Termination: SMD/SMT; Composition: Thick Film; Number of Terminations: 2; Military Standard: Not; Resistance: 510R; Voltage Rating: 50V; Max Power Dissipation: 63mW; Length: 1mm; Height: 0.016inch; Depth: 0.5mm; Width: 0.5mm; Lead Free: Lead Free; REACH SVHC: Unknown; ComponentLink1URL: https://datasheet.ciiva.com/17063/pyu-rc0402-51-rohs-l-6-r-17063430.pdf?src-supplier=Future+Electronics; ComponentLink1Description: https://datasheet.ciiva.com/17063/pyu-rc0402-51-rohs-l-6-r-17063430.pdf?src-supplier=Future+Electronics; ComponentLink2URL: https://datasheet.ciiva.com/2453/pyu-r-int-thick-7-2453397.pdf?src-supplier=Digi-Key; ComponentLink2Description: https://datasheet.ciiva.com/2453/pyu-r-int-thick-7-2453397.pdf?src-supplier=Digi-Key; ComponentLink3URL: https://datasheet.ciiva.com/2453/pyu-r-int-thick-7-2453398.pdf?src-supplier=Digi-Key; ComponentLink3Description: https://datasheet.ciiva.com/2453/pyu-r-int-thick-7-2453398.pdf?src-supplier=Digi-Key; ComponentLink4URL: https://datasheet.ciiva.com/2453/pyu-r-int-thick-7-2453399.pdf?src-supplier=Digi-Key; ComponentLink4Description: https://datasheet.ciiva.com/2453/pyu-r-int-thick-7-2453399.pdf?src-supplier=Digi-Key; Supplier Part Number 1: 311-510LRCT-ND; Mount: Surface Mount; Manufacturer: Yageo; Manufacturer Part Number: RC0402FR-07510RL
R15 = RC0402FR-071KL: RES SMD 1K OHM 1% 1/16W 0402; Manufacturer: Yageo; Resistance: 1kR; Temperature Coefficient: 100ppm/°C; Voltage Rating (DC): 50V; Power Rating: 62.5mW; Supplier 1: Digi-Key; Supplier Part Number 1: 311-1.00KLRCT-ND; Manufacturer Part Number: RC0402FR-071KL; RoHS: Yes; Category: Chip SMD Resistors; Stock 1: 49724898; Pricing 1: 1=0.10000, 10=0.01400, 100=0.00580, 1000=0.00262, 2500=0.00228, 5000=0.00188 (USD); Case/Package: 0402; Number of Pins: 2; Case Code (Imperial): 0402; Case Code (Metric): 1005; Min Operating Temperature: -55°C; Max Operating Temperature: 155°C; Resistor Type: Thick Film; Tolerance: 1%; Packaging: Tape and Reel; Voltage Rating: 50V; Termination: SMD/SMT; Length: 1mm; Width: 0.5mm; Height: 0.32mm; Depth: 0.5mm; REACH SVHC: Unknown; Lead Free: Lead Free; Military Standard: Not; ComponentLink1URL: https://datasheet.ciiva.com/11819/0900766b80c66297-11819477.pdf?src-supplier=RSComponents; ComponentLink1Description: https://datasheet.ciiva.com/11819/0900766b80c66297-11819477.pdf?src-supplier=RSComponents; ComponentLink2URL: https://datasheet.ciiva.com/12666/pyu-rc0402-51-rohs-l-6-r-12666741.pdf?src-supplier=Mouser; ComponentLink2Description: https://datasheet.ciiva.com/12666/pyu-rc0402-51-rohs-l-6-r-12666741.pdf?src-supplier=Mouser; ComponentLink3URL: https://datasheet.ciiva.com/17063/pyu-rc0402-51-rohs-l-6-r-17063193.pdf?src-supplier=Future+Electronics; ComponentLink3Description: https://datasheet.ciiva.com/17063/pyu-rc0402-51-rohs-l-6-r-17063193.pdf?src-supplier=Future+Electronics; ComponentLink4URL: https://datasheet.ciiva.com/22747/1018594-22747513.pdf?src-supplier=Element14; ComponentLink4Description: https://datasheet.ciiva.com/22747/1018594-22747513.pdf?src-supplier=Element14; ComponentLink5URL: https://datasheet.ciiva.com/7849/1018594-7849869.pdf?src-supplier=Element14; ComponentLink5Description: https://datasheet.ciiva.com/7849/1018594-7849869.pdf?src-supplier=Element14; ComponentLink6URL: https://datasheet.ciiva.com/7983/1018594-7983502.pdf?src-supplier=Element14; ComponentLink6Description: https://datasheet.ciiva.com/7983/1018594-7983502.pdf?src-supplier=Element14; ComponentLink7URL: https://datasheet.ciiva.com/7849/1018594-7849871.pdf?src-supplier=Element14; ComponentLink7Description: https://datasheet.ciiva.com/7849/1018594-7849871.pdf?src-supplier=Element14
SW1 SW2 = SKRPACE010: SWITCH TACTILE SPST-NO 0.05A 16V; Manufacturer: Alps Electric; Actuator Type: STEM; Circuit Configuration: 1X1; Contact Current(DC)-Max: 50mA; Contact DC Max Rating R Load: .05A@16VDC; Electrical Life: 50000Cycles; Number of Switches: 1; Operating Force-Max: 2.55N; Switch Action: MOMENTARY-TACTILE; Switch Function: SPST; Switch Type: Keypad; Body Breadth: 3.2inch; Body Height: 1.6mm; Body Length or Diameter: 4.2mm; Supplier 1: Mouser; Supplier Part Number 1: 688-SKRPACE010; Manufacturer Part Number: SKRPACE010; RoHS: Yes; Category: Tactile Switches; Stock 1: 4937; Pricing 1: 1=0.35000, 10=0.34500, 50=0.31500, 100=0.29500, 1000=0.29500, 10000=0.29400 (USD); Mounting Technology: Surface Mount; Terminal Finish: Silver; Min Operating Temperature: -30°C; Max Operating Temperature: 85°C; JESD-609 Code: e4; Contact Voltage(DC)-Max: 16V; Packaging: Tape and Reel; Termination: Solder; Reach SVHC Compliant: Yes; RoHS Compliant: Yes; ComponentLink1URL: https://datasheet.ciiva.com:443/pdfs/VipMasterIC/IC/ALPS/ALPS-S-A0002902398/ALPS-S-A0002902265-1.pdf?src-supplier=IHS+Markit; ComponentLink1Description: https://datasheet.ciiva.com:443/pdfs/VipMasterIC/IC/ALPS/ALPS-S-A0002902398/ALPS-S-A0002902265-1.pdf?src-supplier=IHS+Markit; ComponentLink2URL: https://datasheet.ciiva.com/16156/skrp-16156208.pdf?src-supplier=Onlinecomponents.com; ComponentLink2Description: https://datasheet.ciiva.com/16156/skrp-16156208.pdf?src-supplier=Onlinecomponents.com; ComponentLink3URL: https://datasheet.ciiva.com/18145/getdatasheetpartid-652528-18145947.pdf?src-supplier=Verical; ComponentLink3Description: https://datasheet.ciiva.com/18145/getdatasheetpartid-652528-18145947.pdf?src-supplier=Verical
U1 = BQ25180YBGR: IC 1-A LI-ION IC PROGRAMMABLE CHARG; Manufacturer: Texas Instruments; Supplier 1: Digi-Key; Supplier Part Number 1: 296-BQ25180YBGRCT-ND; Manufacturer Part Number: BQ25180YBGR; RoHS: No; Stock 1: 5326; Pricing 1: 1=2.78000, 10=2.50000, 25=2.35840, 100=2.00940, 250=1.88680, 500=1.65096, 1000=1.42400 (USD); ComponentLink1Description: https://www.ti.com/lit/ds/symlink/bq25180.pdf?ts=1664107697804&ref_url=https%253A%252F%252Fwww.ti.com%252Fproduct%252FBQ25180; ComponentLink1URL: https://www.ti.com/lit/ds/symlink/bq25180.pdf?ts=1664107697804&ref_url=https%253A%252F%252Fwww.ti.com%252Fproduct%252FBQ25180
U2 = 74LVC4066BQ,115: IC SWITCH QUAD SPST 14DHVQFN; Manufacturer: Nexperia; Supplier 1: Digi-Key; Supplier Part Number 1: 1727-3499-1-ND; Manufacturer Part Number: 74LVC4066BQ,115; RoHS: Yes; Category: Decoders and Multiplexers; Stock 1: 53790; Pricing 1: 1=0.67000, 10=0.59300, 25=0.55720, 100=0.45480, 250=0.42248, 500=0.35956, 1000=0.28764 (USD); RoHS Compliant: Yes; ComponentLink1URL: https://assets.nexperia.com/documents/data-sheet/74LVC4066.pdf?src-supplier=Digi-Key; ComponentLink1Description: https://assets.nexperia.com/documents/data-sheet/74LVC4066.pdf?src-supplier=Digi-Key
U3 = NCP167BMX330TBG: IC REG LINEAR 3.3V 700MA 4XDFN; Manufacturer: ON Semiconductor; Supplier 1: Digi-Key; Supplier Part Number 1: NCP167BMX330TBGOSCT-ND; Manufacturer Part Number: NCP167BMX330TBG; RoHS: Yes; Category: Voltage Regulators - Linear; Stock 1: 222045; Pricing 1: 1=0.61000, 10=0.52500, 25=0.49000, 100=0.39210, 250=0.36408, 500=0.30806, 1000=0.23804 (USD); RoHS Compliant: Yes; ComponentLink1URL: http://www.farnell.com/datasheets/2711391.pdf?src-supplier=Farnell; ComponentLink1Description: http://www.farnell.com/datasheets/2711391.pdf?src-supplier=Farnell; ComponentLink2URL: https://www.onsemi.com/pub/Collateral/NCP167-D.PDF?src-supplier=Digi-Key; ComponentLink2Description: https://www.onsemi.com/pub/Collateral/NCP167-D.PDF?src-supplier=Digi-Key; ComponentLink3URL: http://www.farnell.com/datasheets/2711391.pdf?src-supplier=Newark; ComponentLink3Description: http://www.farnell.com/datasheets/2711391.pdf?src-supplier=Newark
U4 = RP2040: IC MCU 32BIT EXT MEM 56QFN; Manufacturer: Raspberry Pi; Core Processor: ARM® Cortex®-M0+; Core Size: 32-Bit Dual-Core; Speed: 133MHz; Connectivity: I²C, IrDA, QSPI, SPI, UART/USART, USB; Peripherals: Brown-out Detect/Reset, DMA, I²S, LCD, POR, PWM, WDT; Number of I/O: 30; Program Memory Type: External Program Memory; Supplier 1: Digi-Key; Supplier Part Number 1: 2648-SC0914(13)CT-ND; Manufacturer Part Number: RP2040; RoHS: ROHS3 Compliant; Category: Microcontrollers; Stock 1: 105275; Pricing 1: 1=1.00000 (USD); ComponentLink1Description: https://datasheets.raspberrypi.com/rp2040/rp2040-datasheet.pdf; ComponentLink1URL: https://datasheets.raspberrypi.com/rp2040/rp2040-datasheet.pdf; Supplier 2: LCSC; Supplier Part Number 2: C90603; Stock 2: 4615; Pricing 2: 5=0.25540, 50=0.20930, 150=0.18950, 500=0.15170, 3000=0.14080, 6000=0.13430 (USD)
U5 = MX25R1635FZUIL0: IC FLASH 16MBIT SPI/QUAD 8USON; Manufacturer: Macronix; Memory Type: Non-Volatile,FLASH; Memory Size: 16Mb; Frequency: 33MHz; Supplier 1: Digi-Key; Supplier Part Number 1: 1092-1204-2-ND; Manufacturer Part Number: MX25R1635FZUIL0; RoHS: Yes; Category: Memory; Stock 1: 217224; Pricing 1: 12000=0.58880 (USD); Mount: Surface Mount; Min Operating Temperature: -40°C; Max Operating Temperature: 85°C; Packaging: Tape and Reel; RoHS Compliant: Yes; Lead Free: Lead Free; ComponentLink1URL: http://ckassoc.com/oldsite/pdf/Macronix_Product_Line_Card_July_2017_General%20_070617.pdf?src-supplier=Digi-Key; ComponentLink1Description: http://ckassoc.com/oldsite/pdf/Macronix_Product_Line_Card_July_2017_General%20_070617.pdf?src-supplier=Digi-Key
X1 = Q24FA20H0068700: CRYSTAL 12.0000MHZ 10PF SMD; Manufacturer: Seiko; Supplier 1: LCSC; Supplier Part Number 1: C90603; Manufacturer Part Number: Q24FA20H0068700; RoHS: Yes; Stock 1: 4615; Pricing 1: 5=0.25540, 50=0.20930, 150=0.18950, 500=0.15170, 3000=0.14080, 6000=0.13430 (USD)
J2 J3 = Double_Header_1x11_2.54: Manufacturer: *; Manufacturer Part Number: *; Category: *; Supplier 1: *; Supplier Unit Price 1: *; Supplier Currency 1: *
J4 = Double_Header_1x3_2.54: Manufacturer: *; Manufacturer Part Number: *; Category: *; Supplier 1: *; Supplier Unit Price 1: *; Supplier Currency 1: *